# EAGLE design PS2 to UART RS232 revA (EAGLE 7.2.0)
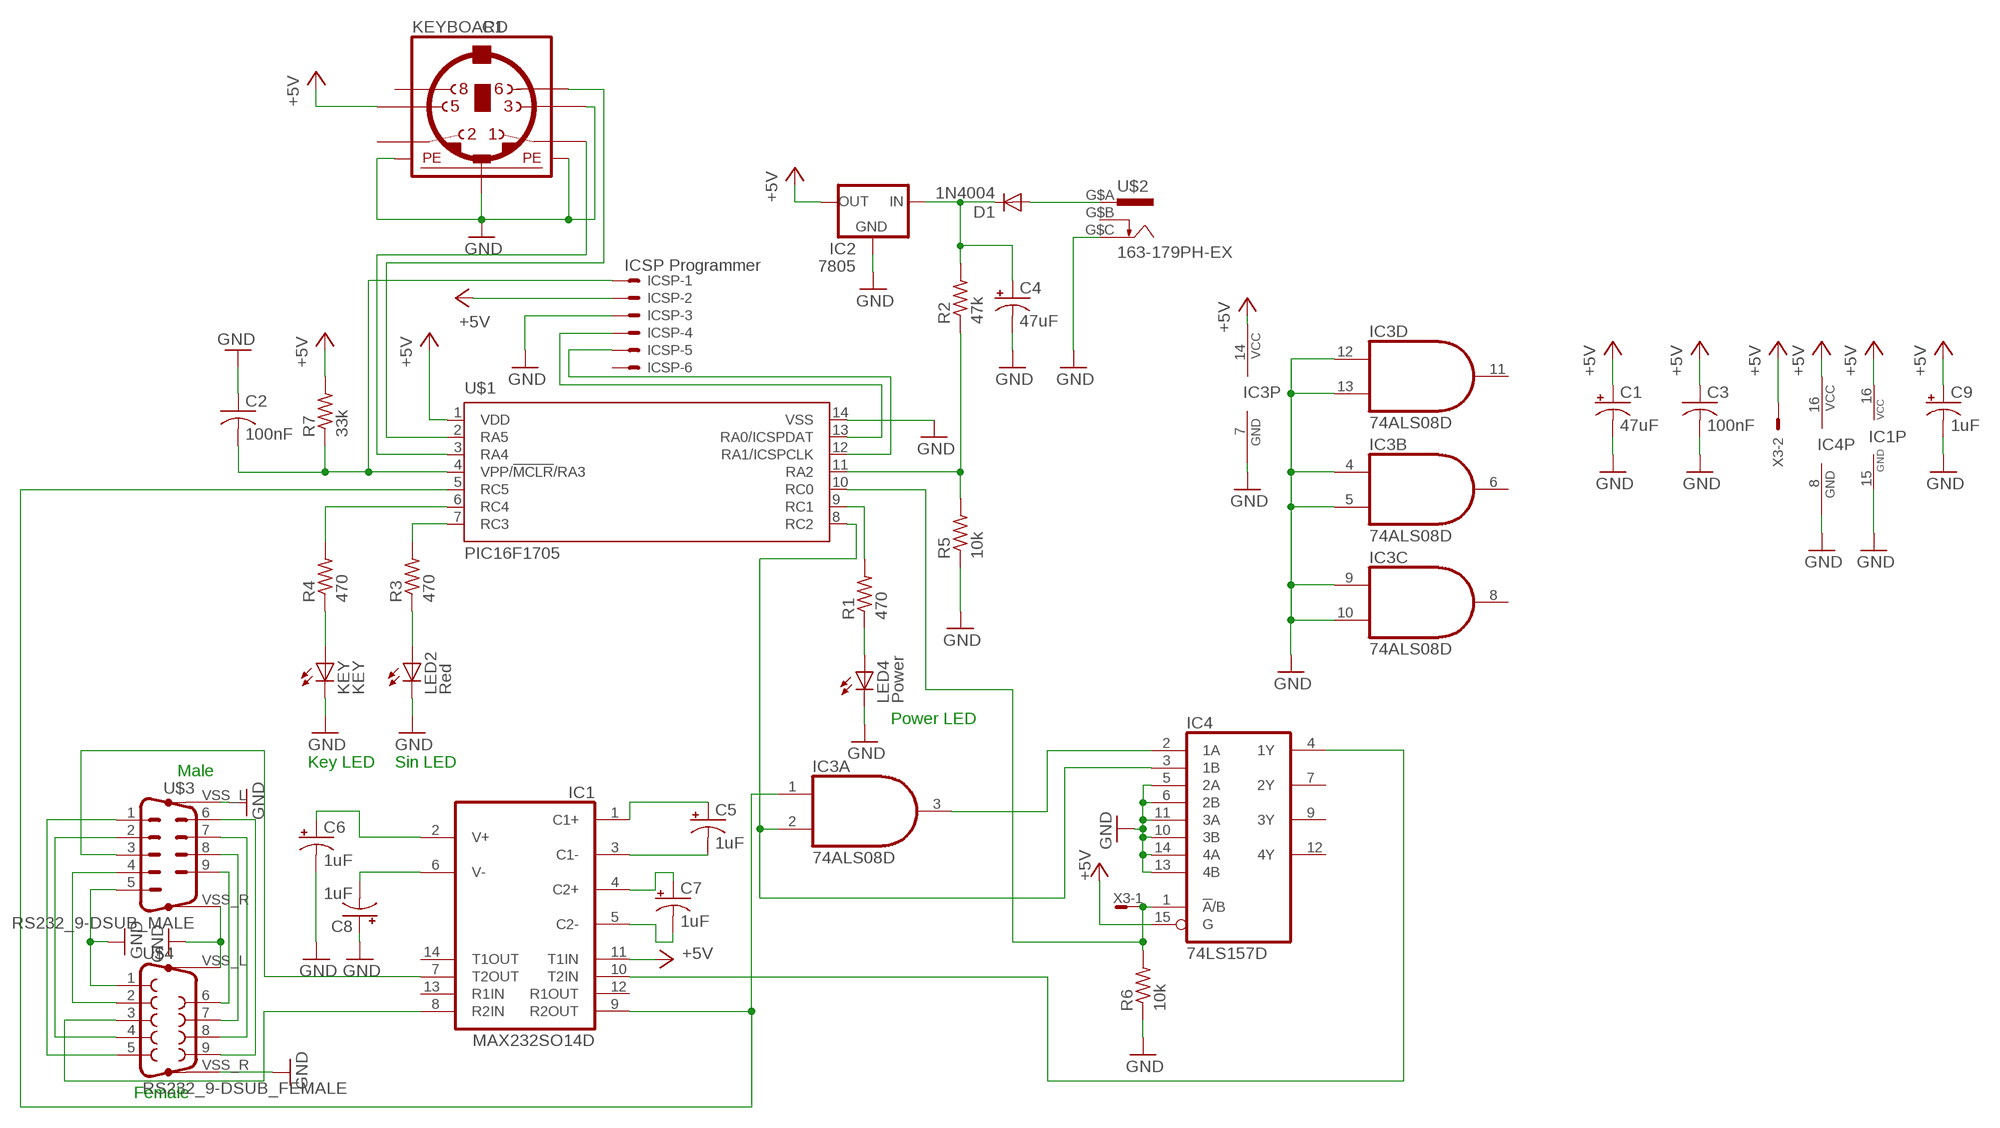
[diagram p0: schematic, sheet 1]

## Parts
C1  47uF  CPOL-USE2.5-7  [E2,5-7]
C2  100nF  C-US025-030X050  [C025-030X050]
C3  100nF  C-US025-030X050  [C025-030X050]
C4  47uF  CPOL-USE2.5-7  [E2,5-7]
C5  1uF  CPOL-USE5-4  [E5-4]
C6  1uF  CPOL-USE5-4  [E5-4]
C7  1uF  CPOL-USE5-4  [E5-4]
C8  1uF  CPOL-USE5-4  [E5-4]
C9  1uF  CPOL-USE5-4  [E5-4]
D1  1N4004  [DO41-10]
IC1  MAX232SO14D  [SO16]
IC2  7805  78XXL  [78XXL]
IC3  74ALS08D  [SO14]
IC4  74LS157D  [SO16]
ICSP  ICSP Programmer  22-23-2061  [22-23-2061]
KEY  KEY  LED5MM  [LED5MM]
KEYBOARD  C1  MINI_DIN_6  [M_DIN6]
LED2  Red  LED5MM  [LED5MM]
LED4  Power  LED5MM  [LED5MM]
R1  470  R-US_0207/10  [0207/10]
R2  47k  R-US_0207/10  [0207/10]
R3  470  R-US_0207/10  [0207/10]
R4  470  R-US_0207/10  [0207/10]
R5  10k  R-US_0207/10  [0207/10]
R6  10k  R-US_0207/10  [0207/10]
R7  33k  R-US_0207/10  [0207/10]
U$1  PIC16F1705  [SO-14]
U$2  163-179PH-EX  [163-179PH]
U$3  RS232_9-DSUB_MALE  [182-009-MALE]
U$4  RS232_9-DSUB_FEMALE  [182-009-MALE]
X3  22-23-2021  [22-23-2021]

## Nets
+5V: C1.+ C3.1 C9.+ IC1.11(T1IN) IC1.16(VCC) IC2.OUT IC3.14(P:VCC) IC4.15(G) IC4.16(VCC) ICSP.2 KEYBOARD.5 R7.2 U$1.1(VDD) X3.2
N$1: KEYBOARD.1 U$1.3(RA4)
N$2: R3.2 U$1.7(RC3)
N$3: C2.2 ICSP.1 R7.1 U$1.4(VPP/!MCLR!/RA3)
N$4: R4.2 U$1.6(RC4)
N$5: LED2.A R3.1
N$6: KEY.A R4.1
N$8: R2.1 R5.2 U$1.11(RA2)
N$9: LED4.A R1.1
N$10: R1.2 U$1.9(RC1)
N$11: D1.A U$2.G$A
N$12: C4.+ D1.C IC2.IN R2.2
N$14: IC3.3(A:O) IC4.2(1A)
N$15: IC3.2(A:I1) IC4.3(1B) U$1.8(RC2)
N$17: KEYBOARD.6 U$1.2(RA5)
N$19: IC1.9(R2OUT) IC3.1(A:I0) U$1.5(RC5)
N$20: IC4.1(!A!/B) R6.2 U$1.10(RC0) X3.1
N$21: C8.- IC1.6(V-)
N$22: IC1.10(T2IN) IC4.4(1Y)
N$23: C6.+ IC1.2(V+)
N$24: C7.+ IC1.4(C2+)
N$25: C7.- IC1.5(C2-)
N$26: C5.- IC1.3(C1-)
N$27: C5.+ IC1.1(C1+)
N$28: U$3.9 U$4.6
N$29: U$3.8 U$4.7
N$30: U$3.7 U$4.8
N$31: U$3.6 U$4.9
N$32: U$3.1 U$4.5
N$33: U$3.4 U$4.2
N$34: U$3.2 U$4.4
N$35: IC1.7(T2OUT) U$3.3
N$36: IC1.8(R2IN) U$4.3
N$37: ICSP.4 U$1.13(RA0/ICSPDAT)
N$38: ICSP.5 U$1.12(RA1/ICSPCLK)
VSS: C1.- C2.1 C3.2 C4.- C6.- C8.+ C9.- IC1.15(GND) IC2.GND IC3.4(B:I0) IC3.5(B:I1) IC3.7(P:GND) IC3.9(C:I0) IC3.10(C:I1) IC3.12(D:I0) IC3.13(D:I1) IC4.5(2A) IC4.6(2B) IC4.8(GND) IC4.10(3B) IC4.11(3A) IC4.13(4B) IC4.14(4A) ICSP.3 KEY.K(C) KEYBOARD.3 KEYBOARD.SH1(PE1) KEYBOARD.SH2(PE2) KEYBOARD.SH3(PE3) LED2.K(C) LED4.K(C) R5.1 R6.1 U$1.14(VSS) U$2.G$C U$3.5 U$3.VSS_L(G1) U$3.VSS_R(G2) U$4.1 U$4.VSS_L(G1) U$4.VSS_R(G2) ; supply symbol labelled GND
Unconnected: IC1.12(R1OUT) IC1.13(R1IN) IC1.14(T1OUT) IC3.6(B:O) IC3.8(C:O) IC3.11(D:O) IC4.7(2Y) IC4.9(3Y) IC4.12(4Y) ICSP.6 KEYBOARD.2 KEYBOARD.8 U$2.G$B

## Notes on the sheet
- Power LED
- Key LED | Sin LED
- Male
- Female

## Library data of the parts
C1 C4 = rcl:CPOL-US: POLARIZED CAPACITOR, American symbol
C2 C3 = rcl:C-US: CAPACITOR, American symbol
C5-C9 = resistor:CPOL-US: POLARIZED CAPACITOR, American symbol
D1 = diode:1N4004: DIODE general purpose rectifier, 1 A
IC1 = maxim:MAX232: RS232 TRANSCEIVER
IC2 = v-reg:78XXL: VOLTAGE REGULATOR
IC3 = 74xx-us:74*08: Quad 2-input AND gate
IC4 = 74xx-us:74*157: Quadruple 2-line to 1-line data SELECTOR/MULTIPLEXER
ICSP = con-molex:22-23-2061: .100" (2.54mm) Center Header - 6 Pin; MF: MOLEX; MPN: 22-23-2061; OC_FARNELL: 1462922; OC_NEWARK: 27C1933
KEY LED2 LED4 = led:LED: LED OSRAM: - CHIPLED LG R971, LG N971, LY N971, LG Q971, LY Q971, LO R971, LY R971 LH N974, LH R974 LS Q976, LO Q976, LY Q976 LO Q996 - Hyper CHIPLED LW Q18S LB Q993, LB Q99A, LB R99A - SideLED LS A670, LO A670, LY A670, LG A670, LP A670 LB A673, LV A673, LT A673, LW A673 LH A674 LY A675 LS A676, LA A676, LO A676, LY A676, LW A676 LS A679, LY A679, LG A679 - Hyper Micro SIDELED® LS Y876, LA Y876, LO Y876, LY Y876 LT Y87S - SmartLED LW L88C, LW L88S LB L89C, LB L89S, LG L890 LS L89K, LO L89K, LY L89K LS L896, LA L896, LO L896, LY L896 - TOPLED LS T670, LO T670, LY T670, LG T670, LP T670 LSG T670, LSP T670, LSY T670, LOP T670, LYG T670 LG T671, LOG T671, LSG T671 LB T673, LV T673, LT T673, LW T673 LH T674 LS T676, LA T676, LO T676, LY T676, LB T676, LH T676, LSB T676, LW T676 LB T67C, LV T67C, LT T67C, LS T67K, LO T67K, LY T67K, LW E67C LS E67B, LA E67B, LO E67B, LY E67B, LB E67C, LV E67C, LT E67C LW T67C LS T679, LY T679, LG T679 LS T770, LO T770, LY T770, LG T770, LP T770 LB T773, LV T773, LT T773, LW T773 LH T774 LS E675, LA E675, LY E675, LS T675 LS T776, LA T776, LO T776, LY T776, LB T776 LHGB T686 LT T68C, LB T68C - Hyper Mini TOPLED® LB M676 - Mini TOPLED Santana® LG M470 LS M47K, LO M47K, LY M47K Source: http://www.osram.convergy.de LUXEON: - LUMILED® LXK2-PW12-R00, LXK2-PW12-S00, LXK2-PW14-U00, LXK2-PW14-V00 LXK2-PM12-R00, LXK2-PM12-S00, LXK2-PM14-U00 LXK2-PE12-Q00, LXK2-PE12-R00, LXK2-PE12-S00, LXK2-PE14-T00, LXK2-PE14-U00 LXK2-PB12-K00, LXK2-PB12-L00, LXK2-PB12-M00, LXK2-PB14-N00, LXK2-PB14-P00, LXK2-PB14-Q00 LXK2-PR12-L00, LXK2-PR12-M00, LXK2-PR14-Q00, LXK2-PR14-R00 LXK2-PD12-Q00, LXK2-PD12-R00, LXK2-PD12-S00 LXK2-PH12-R00, LXK2-PH12-S00 LXK2-PL12-P00, LXK2-PL12-Q00, LXK2-PL12-R00 Source: www.luxeon.com KINGBRIGHT: KA-3528ASYC Source: www.kingbright.com
KEYBOARD = mini_din:MINI_DIN_6
R1-R7 = rcl:R-US_: RESISTOR, American symbol
U$1 = microchip:PIC16F1705: Cost Effective 8-Bit Intelligent Analog Flash Microcontrollers
U$2 = con-kycon:163-179PH-EX: PC Mount DC Power Jacks 163-179PH -EX, 163-180PH-EX
U$3 = con-subd:RS232_9-DSUB_MALE: male rs232 connector dsub
U$4 = con-subd:RS232_9-DSUB_FEMALE: Female RS_232 dsub connector
X3 = con-molex:22-23-2021: .100" (2.54mm) Center Header - 2 Pin; MF: MOLEX; MPN: 22-23-2021; OC_FARNELL: 1462926; OC_NEWARK: 25C3832

## Board
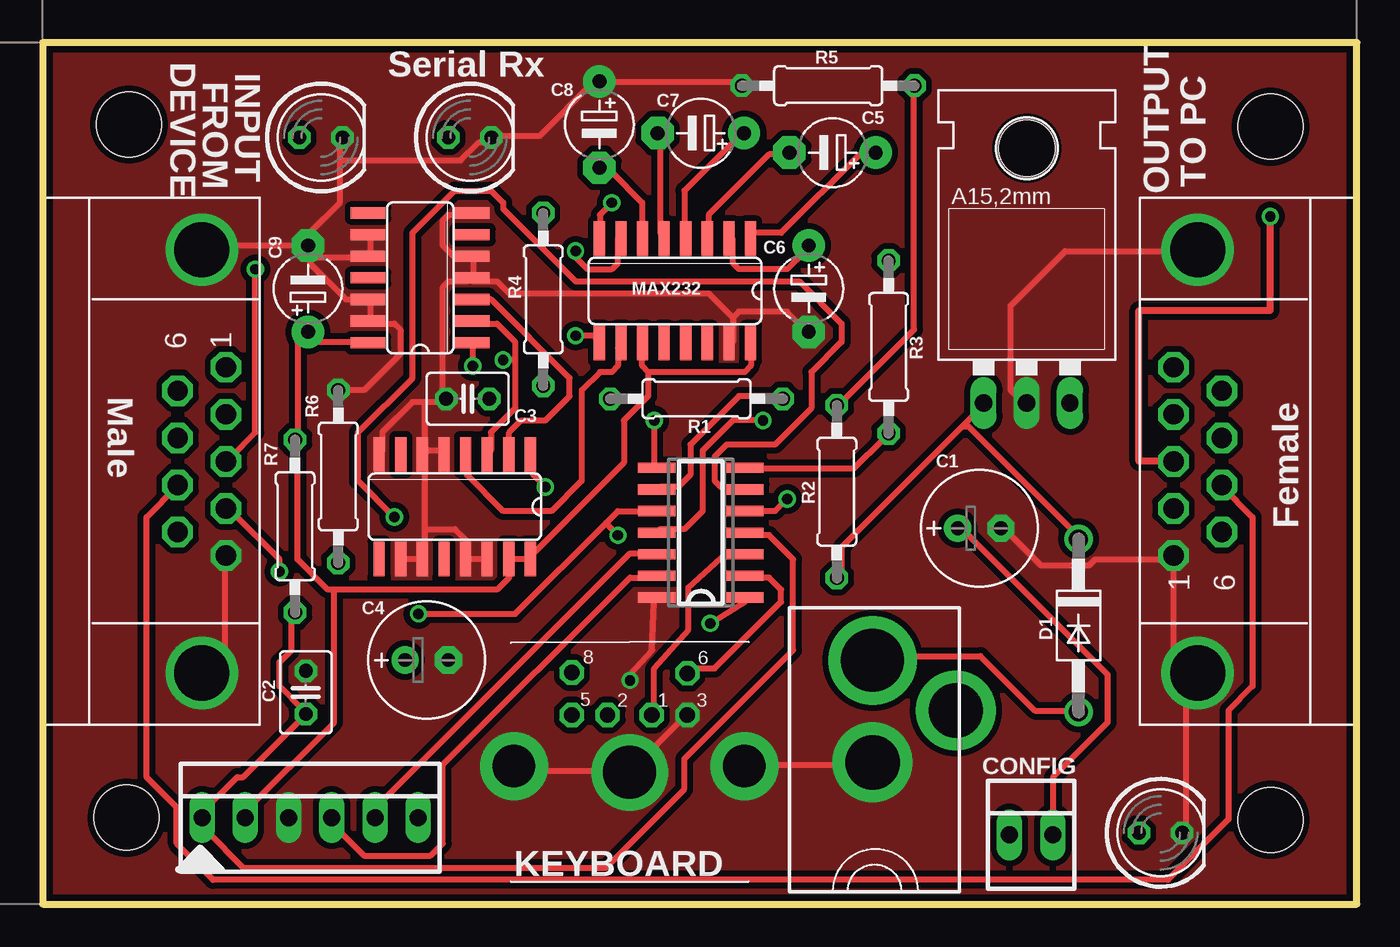
[diagram p1: board, top side]
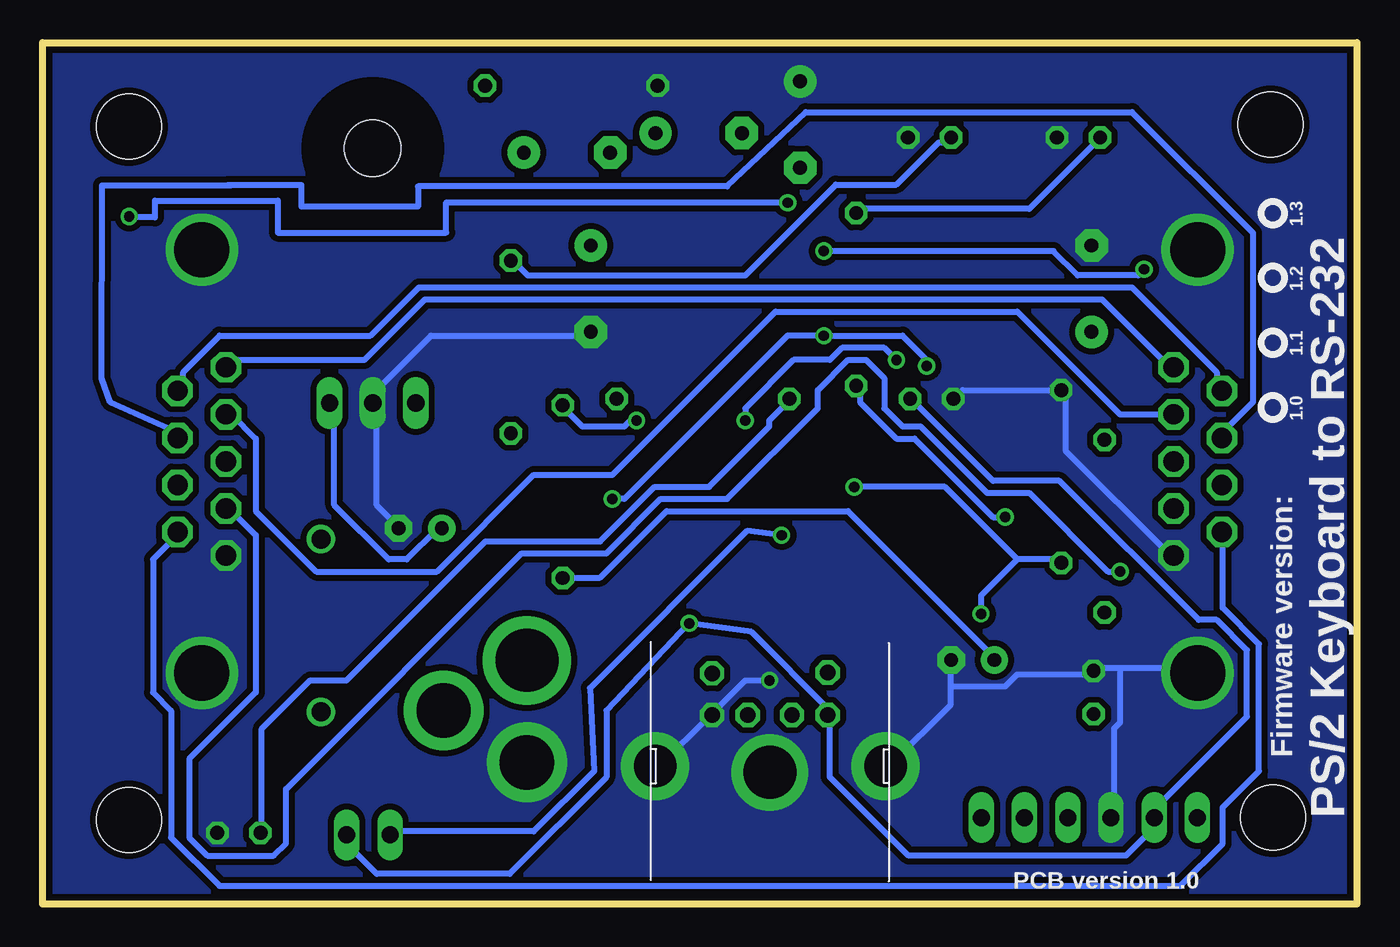
[diagram p2: board, bottom side, seen from below]

Size 77.34 x 50.67 mm. Coordinates in mm from the lower left corner, seen from the top.
Outline: 0,0 77.34,0 77.34,50.67 0,50.67 0,0
Copper layers (1*16): Top 0.035mm / dielectric 1.5mm / Bottom 0.035mm
Design rules "default *": minimum track width 14mil, minimum drill 24mil, track to track 14mil, track to pad 20mil, pad to pad 20mil, via to via 20mil, smd to smd 20mil, copper to edge 15mil, drill to drill 8mil, minimum pad ring 10mil, minimum via ring 8mil, stop-mask expansion 4mil, vias tented up to drill 0mil, thermal gap 16mil
Holes 3.81 mm at 4.95,5.08 72.26,4.95 72.26,45.72 5.08,45.85

### Footprints (pad centres in the part's own frame; a part is rotated, then mirrored left to right if it is on the bottom)
E2,5-7 = drill 0.813 pad 1.6: + -1.27,0 | drill 0.813 pad 1.6 octagon: - 1.27,0
C025-030X050 = drill 0.813 octagon: 1 -1.27,0; 2 1.27,0
E5-4 = drill 0.813 pad 1.905: + -2.54,0 | drill 0.813 pad 1.905 octagon: - 2.54,0
DO41-10 = drill 1.118: A 5.08,0; C -5.08,0
SO16 = smd 0.66 x 2.032: 1 -4.445,-3.073; 2 -3.175,-3.073; 3 -1.905,-3.073; 4 -0.635,-3.073; 5 0.635,-3.073; 6 1.905,-3.073; 7 3.175,-3.073; 8 4.445,-3.073; 9 4.445,3.073; 10 3.175,3.073; 11 1.905,3.073; 12 0.635,3.073; 13 -0.635,3.073; 14 -1.905,3.073; 15 -3.175,3.073; 16 -4.445,3.073
78XXL = drill 1.016 long: GND 0,-3.81; IN -2.54,-3.81; OUT 2.54,-3.81 | hole 3.302: 0,11.176
SO14 = smd 0.66 x 2.032: 1 -3.81,-3.073; 2 -2.54,-3.073; 3 -1.27,-3.073; 4 0,-3.073; 5 1.27,-3.073; 6 2.54,-3.073; 7 3.81,-3.073; 8 3.81,3.073; 9 2.54,3.073; 10 1.27,3.073; 11 0,3.073; 12 -1.27,3.073; 13 -2.54,3.073; 14 -3.81,3.073
22-23-2061 = drill 1 long: 1 -6.35,0; 2 -3.81,0; 3 -1.27,0; 4 1.27,0; 5 3.81,0; 6 6.35,0
LED5MM = drill 0.813 octagon: A -1.27,0; K 1.27,0
M_DIN6 = drill 0.9 pad 1.422 octagon: 1 -1.3,-3.75; 2 1.3,-3.75; 3 -3.4,-3.75; 5 3.4,-3.75; 6 -3.4,-6.2; 8 3.4,-6.25 | drill 2.5 pad 4: SH1 6.8,-0.75; SH3 -6.75,-0.75 | drill 3.1 pad 4.5: SH2 0,-0.381
0207/10 = drill 0.813 octagon: 1 -5.08,0; 2 5.08,0
SO-14 = smd 0.6 x 2.2: 1 -3.81,-2.6; 2 -2.54,-2.6; 3 -1.27,-2.6; 4 0,-2.6; 5 1.27,-2.6; 6 2.54,-2.6; 7 3.81,-2.6; 8 3.81,2.6; 9 2.54,2.6; 10 1.27,2.6; 11 0,2.6; 12 -1.27,2.6; 13 -2.54,2.6; 14 -3.81,2.6
163-179PH = drill 3.7 pad 5.2: G$A 4.9,13.7 | drill 3.2 pad 4.7: G$B 9.8,10.75; G$C 4.9,7.7
182-009-MALE = drill 1.194 pad 1.524 octagon: 1 -5.537,10.923; 2 -2.769,10.923; 3 0,10.923; 4 2.769,10.923; 5 5.537,10.923; 6 -4.153,8.08; 7 -1.384,8.08; 8 1.384,8.08; 9 4.153,8.08 | drill 3.239: VSS_L -12.446,9.501; VSS_R 12.446,9.501
22-23-2021 = drill 1 long: 1 -1.27,0; 2 1.27,0

### Placement (x,y rotation side)
C1  55.12,22.1 0 top
C2  15.49,12.45 270 top
C3  25.02,29.72 180 top
C4  22.61,14.35 0 top
C5  46.48,44.2 180 top
C6  45.09,36.2 270 top
C7  38.73,45.34 180 top
C8  32.77,45.85 270 top
C9  15.62,36.2 90 top
D1  60.96,16.38 270 top
IC1  37.21,36.07 180 top
IC2  57.91,33.27 0 top
IC3  22.23,36.83 90 top
IC4  24.26,23.37 180 top
ICSP  15.75,5.08 0 top
KEY  16.38,45.09 0 top
KEYBOARD  34.54,7.37 180 top
LED2  25.15,45.09 0 top
LED4  65.79,4.19 0 top
R1  38.48,29.72 0 top
R2  46.74,24.26 270 top
R3  49.78,32.77 270 top
R4  29.46,35.56 270 top
R5  46.23,48.13 0 top
R6  17.4,25.15 270 top
R7  14.86,22.23 90 top
U$1  38.73,21.84 90 top
U$2  43.94,0.64 0 top
U$3  -0.13,26.04 270 top
U$4  77.47,26.04 90 top
X3  58.17,4.06 0 top

### Tracks (layer width: path | path; a pad name or v marks a point on that pad's centre or on a via)
+5V  (via drill 0.61)
  Top 0.356: IC3.14 18.92,33.07 16.08,33.07 15.72,33.43 C9.+ 15.37,33.43 15.01,33.07 15.01,27.38 R7.2 15.01,27.03 15.01,20.27 16.79,18.49 17.14,18.49 | 27.46,20.27 28.52,20.27 IC4.16 28.88,20.62 34.21,25.96 34.21,28.45 35.64,29.87 35.64,31.29 | 35.64,31.29 35.28,31.65 35.28,32.72 IC1.11 | 35.64,31.29 41.33,31.29 41.68,31.65 41.68,32.72 IC1.16 | 17.14,18.49 26.75,18.49 27.46,19.2 27.46,20.27 | 27.46,20.27 IC4.15 | X3.2 59.46,4.27 59.46,7.47 62.66,10.67 62.66,13.51 54.13,22.05 C1.+ | v39.29,16.51 41.33,17.78 U$1.1 | 17.14,18.49 17.14,10.67 11.81,5.33 ICSP.2
  Bottom 0.356: IC2.OUT 60.17,29.16 60.17,23.47 56.97,20.27 55.91,20.27 54.13,22.05 C1.+ | C3.1 26.03,29.52 21.41,24.89 17.5,24.89 9.32,16.71 8.25,16.71 6.48,14.94 6.48,11.02 12.17,5.33 ICSP.2 12.17,4.98 12.17,4.27 13.59,2.85 26.39,2.85 31.01,7.47 31.01,11.02 KEYBOARD.5 31.01,11.38 35.64,16 v39.29,16.51 44.17,11.38 44.17,7.47 49.86,1.78 57.68,1.78 59.11,3.2 59.11,3.91 X3.2
N$1
  Top 0.356: U$1.3 41.33,20.62 40.26,20.62 38,18.62 38,16.13 35.99,13.87 35.99,11.38 KEYBOARD.1
N$2
  Top 0.356: U$1.7 41.68,25.6 47.73,25.6 49.51,27.38 R3.2
N$3
  Top 0.356: R7.1 14.66,17.07 14.66,14.94 13.95,14.22 13.95,12.8 15.37,11.38 C2.2 15.37,11.02 11.81,7.47 11.46,7.47 9.32,5.33 ICSP.1 9.68,4.98 9.68,4.27 11.81,2.13 33.15,2.13 37.77,6.76 37.77,8.53 44.17,14.94 44.17,20.27 42.75,21.69 41.68,21.69 U$1.4
N$4  (via drill 0.61)
  Top 0.356: v20.7,22.76 18.57,24.89 18.57,27.74 21.77,30.94 21.77,39.47 24.26,41.96 26.39,41.96 27.1,41.25 27.1,40.89 31.37,36.63 44.53,36.63 47.02,34.14 47.02,33.07 45.24,31.29 45.24,29.16 43.1,27.03 40.26,27.03 39.55,26.31 39.55,24.89 39.9,24.54 41.33,24.54 U$1.6
  Bottom 0.356: v20.7,22.76 21.41,22.76 26.03,27.38 27.1,27.38 29.23,29.52 29.23,30.23 R4.2
N$5
  Bottom 0.356: LED2.A 23.9,44.81 24.61,44.81 27.1,42.32 30.66,42.32 35.99,36.98 48.79,36.98 49.51,37.69 R3.1
N$6
  Bottom 0.356: R4.1 29.23,40.89 19.28,40.89 15.37,44.81 KEY.A
N$8  (via drill 0.61)
  Top 0.356: v42.39,28.45 40.62,28.45 38.84,26.67 38.84,23.11 37.77,22.05 36.35,22.05 U$1.11 | R5.2 51.28,48.01 51.28,33.78 47.02,29.52 R2.1
  Bottom 0.356: v42.39,28.45 42.75,28.45 43.1,28.09 45.59,28.09 46.66,29.16 R2.1
N$9
  Bottom 0.356: R1.1 33.5,29.52 34.57,28.45 34.57,28.09 38.12,24.54 41.33,24.54 44.53,21.34 51.28,21.34 59.46,13.16 61.59,13.16 64.44,10.31 64.44,4.27 LED4.A
N$10
  Top 0.356: U$1.9 36.35,24.54 37.41,24.54 38.12,25.25 38.12,27.03 40.97,29.87 43.46,29.87 R1.2
N$11
  Top 0.356: D1.A 60.88,11.38 58.39,11.38 55.19,14.58 49.15,14.58 U$2.G$A
N$12
  Top 0.356: 54.13,28.09 55.19,29.16 IC2.IN | 54.13,28.09 47.02,20.98 47.02,19.2 R2.2 | 54.13,28.09 54.48,28.09 60.88,21.69 D1.C
  Bottom 0.356: C4.+ 21.41,14.58 29.95,23.11 40.62,23.11 44.53,19.2 46.66,19.2 R2.2
N$14
  Top 0.356: IC3.3 26.39,35.56 31.01,30.94 31.01,29.87 29.59,28.45 28.17,28.45 27.46,27.74 27.46,26.67 IC4.2
N$15  (via drill 0.61)
  Top 0.356: 27.81,32 27.81,33.07 26.75,34.14 25.32,34.14 IC3.2 | 27.81,32 27.81,29.16 26.39,27.74 26.39,26.67 IC4.3 | v35.99,28.45 35.99,25.6 U$1.8 | 27.81,32 v27.1,32
  Bottom 0.356: v35.99,28.45 35.99,29.16 33.15,32 31.01,32 30.3,32.72 27.81,32.72 v27.1,32
N$17
  Top 0.356: U$1.2 41.68,19.2 42.75,19.2 43.46,18.49 43.46,17.78 39.55,13.87 38.12,13.87 KEYBOARD.6
N$19  (via drill 0.61)
  Top 0.356: v25.32,31.65 25.32,32.72 IC3.1 | v31.37,33.43 32.44,33.43 32.79,33.07 IC1.9 | U$1.5 43.1,23.11 v43.81,23.82
  Bottom 0.356: v25.32,31.65 25.32,32 26.75,33.43 v31.37,33.43 33.5,33.43 43.1,23.82 v43.81,23.82
N$20  (via drill 0.61)
  Top 0.356: v29.59,24.54 28.88,25.25 28.88,26.31 IC4.1 | U$1.10 33.86,23.11 33.15,22.4 | 33.15,22.4 27.81,17.07 v22.12,17.07 | 33.15,22.4 v33.86,21.69
  Bottom 0.356: v29.59,24.54 24.26,24.54 19.99,20.27 | 19.99,20.27 17.5,20.27 R6.2 | v22.12,17.07 22.12,18.14 19.99,20.27 | v33.86,21.69 35.89,21.95 45.14,12.7 44.88,7.82 48.44,4.27 56.62,4.27 X3.1
N$21
  Top 0.356: IC1.6 35.28,39.47 35.28,41.25 33.5,43.03 32.79,43.03 C8.-
N$22
  Top 0.356: IC4.4 24.97,26.31 24.97,25.25 27.1,23.11 29.95,23.11 31.73,24.89 31.73,30.23 32.79,31.29 33.5,31.29 33.86,31.65 33.86,32.72 IC1.10
N$23
  Top 0.356: IC1.2 40.62,39.12 40.62,37.69 40.97,37.34 43.81,37.34 44.88,38.41 C6.+
N$24
  Top 0.356: IC1.4 37.77,39.47 37.77,41.96 40.97,45.16 C7.+
N$25
  Top 0.356: IC1.5 36.35,39.47 36.35,45.16 C7.-
N$26
  Top 0.356: IC1.3 39.19,39.47 39.19,40.54 42.75,44.09 43.81,44.09 C5.-
N$27
  Top 0.356: IC1.1 41.68,39.47 43.46,39.47 48.08,44.09 48.79,44.09 C5.+
N$28
  Bottom 0.356: U$3.9 7.9,21.69 7.9,17.42 5.77,15.29 5.77,7.82 7.9,5.69 7.9,3.56 10.39,1.07 66.93,1.07 69.77,3.91 69.77,11.38 70.84,12.45 70.84,20.27 69.42,21.69 U$4.6
N$29
  Top 0.356: U$3.8 7.9,24.54 6.12,22.76 6.12,7.47 7.9,5.69 7.9,3.56 10.03,1.42 66.22,1.42 69.77,4.98 69.77,11.38 71.2,12.8 71.2,22.76 69.42,24.54 U$4.7
N$30
  Bottom 0.356: 66.42,42.27 73.84,42.27 73.86,30.94 73.36,29.52 69.42,27.74 U$4.8 | 66.42,42.27 66.27,42.27 | U$3.7 7.9,27.74 6.12,29.52 6.12,39.47 13.23,46.58 32.44,46.58 37.06,42.22 55.24,42.22 55.24,41.02 62.1,41.02 62.1,42.29 66.42,42.29 66.42,42.27
N$31
  Bottom 0.356: U$3.6 8.25,30.23 8.25,31.29 13.23,36.27 55.19,36.27 58.04,33.43 66.93,33.43 69.06,31.29 69.06,30.23 U$4.9
N$32
  Bottom 0.356: U$3.1 11.1,31.65 15.01,35.56 54.84,35.56 58.39,32 65.86,32 66.22,31.65 U$4.5
N$33  (via drill 0.61)
  Top 0.356: v13.95,19.56 13.95,20.27 11.1,23.11 U$3.4
  Bottom 0.356: v13.95,19.56 14.66,19.56 19.28,24.18 21.77,24.18 25.68,28.09 26.75,28.09 27.81,29.16 27.81,30.94 28.88,32 29.95,32 31.73,30.23 31.73,29.16 37.06,23.82 40.97,23.82 44.17,20.62 49.15,20.62 63.02,6.76 63.02,3.56 63.73,2.85 67.64,2.85 68.71,3.91 68.71,8.53 64.8,12.45 64.8,21.69 66.22,23.11 U$4.2
N$34
  Bottom 0.356: U$3.2 13.95,28.8 19.99,34.85 34.21,34.85 43.81,25.25 48.44,25.25 54.13,19.56 61.24,19.56 64.8,23.11 64.8,27.38 66.22,28.8 U$4.4
N$35  (via drill 0.61)
  Top 0.356: v31.37,38.41 31.37,38.05 32.08,37.34 33.5,37.34 33.86,37.69 33.86,39.12 IC1.7 | v12.52,37.34 12.52,27.74 11.1,26.31 U$3.3
  Bottom 0.356: v31.37,38.41 17.86,38.41 16.43,36.98 12.88,36.98 v12.52,37.34
N$36  (via drill 0.61)
  Top 0.356: v33.5,41.25 32.79,40.54 32.79,39.47 IC1.8
  Top 0.406: v72.24,40.44 72.24,34.92 64.52,34.92 64.52,26.04 U$4.3
  Bottom 0.356: 72.24,40.39 70.74,40.39 70.74,41.38 63.5,41.38 63.5,39.5 53.59,39.5 53.59,41.27 33.5,41.27 v33.5,41.25
  Bottom 0.406: 72.24,40.39 v72.24,40.44
N$37
  Top 0.356: U$1.13 35.99,19.2 34.57,19.2 23.55,8.18 23.55,3.56 22.84,2.85 18.92,2.85 16.79,4.98 ICSP.4
N$38
  Top 0.356: U$1.12 35.99,20.62 34.57,20.62 19.28,5.33 ICSP.5
VSS  (via drill 0.61)
  Top 0.356: v34.57,13.16 34.57,13.51 35.87,14.94 35.99,17.78 U$1.14 | U$2.G$C 48.79,8.18 41.33,8.18 KEYBOARD.SH3 | U$3.5 10.74,20.27 10.74,14.94 9.68,13.87 U$3.VSS_R | KEYBOARD.SH1 27.81,7.82 34.21,7.82 KEYBOARD.SH2 34.57,7.82 37.77,11.02 KEYBOARD.3 | LED4.K 67.28,4.27 67.28,13.16 67.64,13.51 U$4.VSS_L 67.64,13.87 66.57,14.94 66.57,20.27 U$4.1 66.22,20.27 61.95,20.27 61.59,19.91 58.75,19.91 56.62,22.05 C1.- | 40.62,34.49 40.62,33.07 IC1.15 | 40.62,34.49 40.97,34.85 43.81,34.85 44.88,33.78 C6.- | U$4.VSS_R 67.64,38.41 60.17,38.41 56.97,35.2 56.97,30.23 57.68,29.52 IC2.GND | IC4.14 26.03,20.27 24.97,20.27 IC4.13 24.97,20.62 24.97,21.34 24.26,22.05 22.48,22.05 | IC4.10 21.06,20.27 22.12,20.27 IC4.11 22.48,20.62 22.48,22.05 | 22.48,26.67 23.55,26.67 IC4.5 | 22.48,22.05 22.48,26.31 IC4.6 22.48,26.67 | IC3.4 25.32,36.98 25.32,38.05 IC3.5 24.97,38.05 24.26,38.05 23.55,38.76 23.55,40.18 23.9,40.54 24.97,40.54 IC3.7 | 22.48,29.52 23.55,29.52 C3.2 23.55,29.87 23.55,36.27 23.9,36.63 24.97,36.63 IC3.4 | 22.48,29.52 21.77,29.52 19.99,27.74 19.99,26.67 IC4.8 | 22.48,29.52 22.48,26.67 | R5.1 40.97,48.36 32.79,48.36 C8.+ 32.44,48.36 29.23,45.16 26.75,45.16 LED2.K 26.39,44.81 25.68,44.81 24.61,43.74 17.5,43.74 | IC3.9 19.28,39.12 19.28,38.41 IC3.10 18.92,38.05 15.72,38.05 | 15.72,38.05 15.72,38.41 C9.- | 15.72,38.05 15.72,37.69 17.86,35.56 IC3.12 19.28,35.56 19.28,34.49 IC3.13 19.28,34.14 20.7,34.14 21.06,33.78 21.06,32.36 18.92,30.23 R6.1 | 15.72,38.05 C9.- | 17.5,43.74 17.5,41.25 15.72,39.47 15.72,38.76 C9.- | 17.5,43.74 17.5,44.81 KEY.K | C9.- 15.37,38.76 9.68,38.76 U$3.VSS_L
  Top 0.356: 40.62,34.49 39.19,35.92 27.46,35.92 26.75,36.63 25.32,36.63 IC3.4
  Bottom 0.356: v34.57,13.16 35.99,13.16 37.77,11.38 KEYBOARD.3 38.12,11.02 40.97,8.18 KEYBOARD.SH3 | 13.95,13.87 9.68,13.87 U$3.VSS_R | 13.95,13.87 15.37,13.87 C2.1 15.72,13.51 19.99,13.51 20.7,12.8 23.9,12.8 | 13.95,13.87 13.95,10.67 14.3,10.31 14.3,5.33 ICSP.3 | 23.9,12.8 23.9,11.73 27.46,8.18 KEYBOARD.SH1 | 23.9,12.8 23.9,14.22 C4.- | C1.- 56.62,22.4 57.68,23.47 57.68,29.16 IC2.GND 57.68,29.52 57.68,30.23 54.48,33.43 45.24,33.43 C6.- | C3.2 23.55,29.87 23.19,30.23 R6.1 17.14,30.23 17.14,26.67 11.1,20.62 U$3.5
  pour Top: 52.7,47.88 63.12,47.88 63.12,32.13 52.7,32.13
  pour Bottom (no thermals): 0,50.67 77.34,50.67 77.34,0 0,0
  pour Top (no thermals): 0,50.67 77.34,50.67 77.34,0 0,0

### Text on the board
tPlace: DEVICE | INPUT | Serial Rx | FROM | OUTPUT | TO PC | MAX232 | Male | Female | CONFIG
bPlace: 1.3 | 1.2 | 1.1 | 1.0 | Firmware version: | PS/2 Keyboard to RS-232 | PCB version 1.0